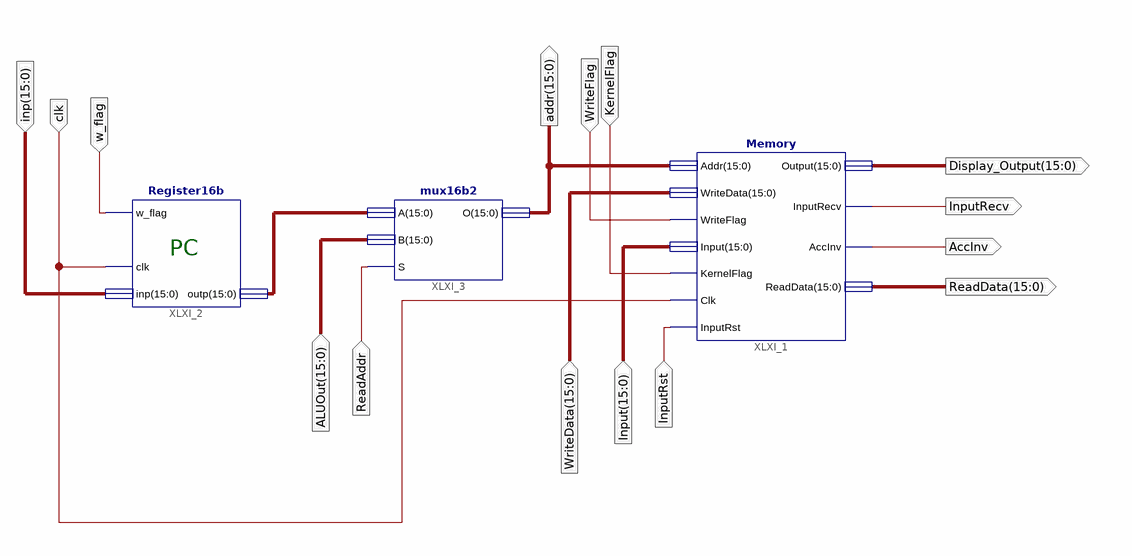
[diagram p0: schematic sheet 1]
// Xilinx ISE schematic Test.sch (spartan3e) as structural Verilog: 3 symbols, 15 ports
module Test (
  input  w_flag,
  input  clk,
  input  [15:0] inp,
  input  [15:0] ALUOut,
  input  ReadAddr,
  input  KernelFlag,
  input  InputRst,
  input  [15:0] Input,
  input  WriteFlag,
  input  [15:0] WriteData,
  output [15:0] addr,
  output InputRecv,
  output AccInv,
  output [15:0] ReadData,
  output [15:0] Display_Output
);

  wire [15:0] XLXN_4;

  Memory XLXI_1 (
    .Addr(addr), .WriteData(WriteData), .WriteFlag(WriteFlag), .Input(Input), .KernelFlag(KernelFlag),
    .Clk(clk), .Output(Display_Output), .AccInv(AccInv), .ReadData(ReadData), .InputRecv(InputRecv),
    .InputRst(InputRst));
  Register16b XLXI_2 (.w_flag(w_flag), .clk(clk), .inp(inp), .outp(XLXN_4));
  mux16b2 XLXI_3 (.A(XLXN_4), .B(ALUOut), .S(ReadAddr), .O(addr));

  // Notes on the sheet:
  //   PC
endmodule
